# EAGLE design M310B (EAGLE 6.6.0)
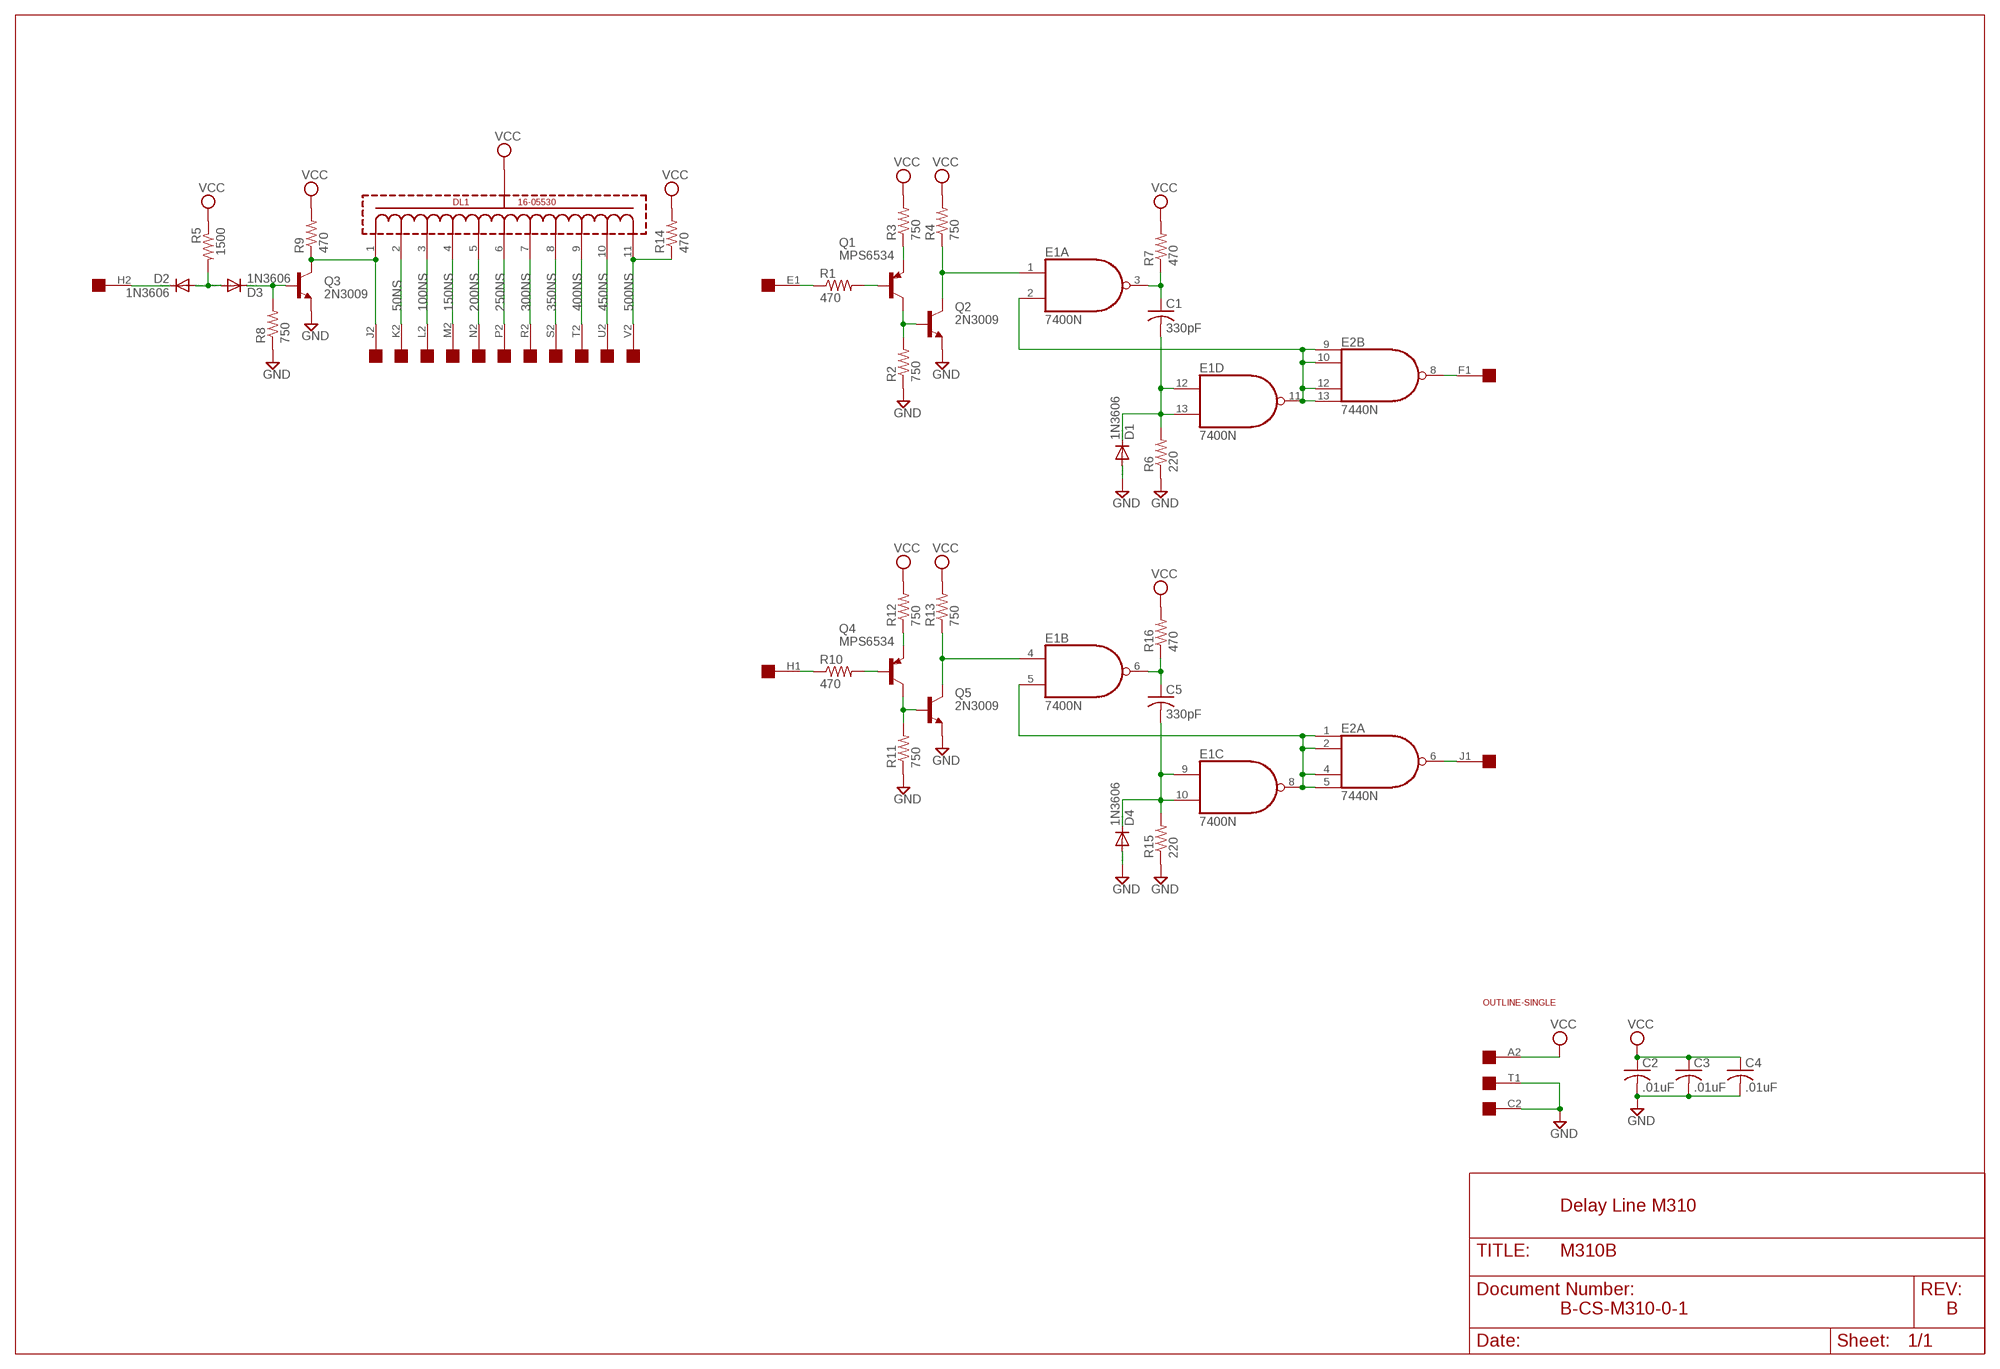
[diagram p0: schematic, sheet 1]

## Parts
C1  330pF  C-US050-025X075  [C050-025X075]
C2  .01uF  C-US050-025X075  [C050-025X075]
C3  .01uF  C-US050-025X075  [C050-025X075]
C4  .01uF  C-US050-025X075  [C050-025X075]
C5  330pF  C-US050-025X075  [C050-025X075]
D1  1N3606  1N4148DO35-10  [DO35-10]
D2  1N3606  1N4148DO35-10  [DO35-10]
D3  1N3606  1N4148DO35-10  [DO35-10]
D4  1N3606  1N4148DO35-10  [DO35-10]
DL1  16-05530  [16-05530]
E1  7400N  [DIL14]
E2  7440N  74S40N  [DIL14]
Q1  MPS6534  2N3637  [TO39]
Q2  2N3009  2N3019-NPN-TO39-EBC  [TO39]
Q3  2N3009  2N3019-NPN-TO39-EBC  [TO39]
Q4  MPS6534  2N3637  [TO39]
Q5  2N3009  2N3019-NPN-TO39-EBC  [TO39]
R1  470  R-US_0207/10  [0207/10]
R2  750  R-US_0207/10  [0207/10]
R3  750  R-US_0207/10  [0207/10]
R4  750  R-US_0207/10  [0207/10]
R5  1500  R-US_0207/10  [0207/10]
R6  220  R-US_0207/10  [0207/10]
R7  470  R-US_0207/10  [0207/10]
R8  750  R-US_0207/10  [0207/10]
R9  470  R-US_0207/10  [0207/10]
R10  470  R-US_0207/10  [0207/10]
R11  750  R-US_0207/10  [0207/10]
R12  750  R-US_0207/10  [0207/10]
R13  750  R-US_0207/10  [0207/10]
R14  470  R-US_0207/10  [0207/10]
R15  220  R-US_0207/10  [0207/10]
R16  470  R-US_0207/10  [0207/10]
U$1  OUTLINE-SINGLE  [SINGLE]
U$4  SINGLE  [EDGE-CON2]

## Nets
50NS: DL1.2 U$4.K2
100NS: DL1.3 U$4.L2
150NS: DL1.4 U$4.M2
200NS: DL1.5 U$4.N2
250NS: DL1.6 U$4.P2
300NS: DL1.7 U$4.R2
350NS: DL1.8 U$4.S2
400NS: DL1.9 U$4.T2
450NS: DL1.10 U$4.U2
500NS: DL1.11 R14.1 U$4.V2
GND [power]: C2.2 C3.2 C4.2 D1.A D4.A Q2.1(E) Q3.1(E) Q5.1(E) R2.1 R6.1 R8.1 R11.1 R15.1 U$4.C2 U$4.T1
N$1: C1.2 D1.C E1.12(D:I0) E1.13(D:I1) R6.2
N$2: D2.C U$4.H2
N$3: D2.A D3.A R5.2
N$4: C1.1 E1.3(A:O) R7.1
N$5: D3.C Q3.2(B) R8.2
N$6: R1.1 U$4.E1
N$7: Q1.2(B) R1.2
N$8: Q1.1(E) R3.1
N$9: Q1.3(C) Q2.2(B) R2.2
N$10: E1.1(A:I0) Q2.3(C) R4.1
N$11: E1.2(A:I1) E1.11(D:O) E2.9(B:I0) E2.10(B:I1) E2.12(B:I2) E2.13(B:I3)
N$12: E2.8(B:O) U$4.F1
N$13: C5.2 D4.C E1.9(C:I0) E1.10(C:I1) R15.2
N$14: R10.1 U$4.H1
N$15: Q4.2(B) R10.2
N$16: Q4.1(E) R12.1
N$17: Q4.3(C) Q5.2(B) R11.2
N$18: E1.4(B:I0) Q5.3(C) R13.1
N$19: C5.1 E1.6(B:O) R16.1
N$20: E1.5(B:I1) E1.8(C:O) E2.1(A:I0) E2.2(A:I1) E2.4(A:I2) E2.5(A:I3)
N$21: E2.6(A:O) U$4.J1
N$23: DL1.1 Q3.3(C) R9.1 U$4.J2
VCC [power]: C2.1 C3.1 C4.1 DL1.12(GND) R3.2 R4.2 R5.1 R7.2 R9.2 R12.2 R13.2 R14.2 R16.2 U$4.A2
Unconnected: E2.3(3:NC) E2.11(11:NC) U$4.A1 U$4.B1 U$4.B2 U$4.C1 U$4.D1 U$4.D2 U$4.E2 U$4.F2 U$4.K1 U$4.L1 U$4.M1 U$4.N1 U$4.P1 U$4.R1 U$4.S1 U$4.U1 U$4.V1

## Notes on the sheet
- Delay Line M310
- B-CS-M310-0-1 | B

## Power pins joined to a net without a drawn wire
GND: E1.7(P:GND) E2.7(P:GND)
VCC: E1.14(P:VCC) E2.14(P:VCC)

## Library data of the parts
C1-C5 = rcl:C-US: CAPACITOR, American symbol
D1-D4 = diode:1N4148: DIODE high speed (Philips)
DL1 = dec-con:16-05530: Delay Line (M310 style)
E1 = 74xx-us:74*00: Quad 2-input NAND gate
E2 = dec-con:74*40: Dual 4-input NAND gate
Q1 Q4 = transistor-pnp:2N3637*: PNP Transistror
Q2 Q3 Q5 = transistor:*-NPN-: NPN Transistror BF959 corrected 2008.03.06
R1-R16 = rcl:R-US_: RESISTOR, American symbol
U$1 = dec-con:OUTLINE-*: Board outlines for DEC boards.
U$4 = dec-con:SINGLE: Single-Height DEC board

## Net classes
1 power: width 0.813 mm

## Board
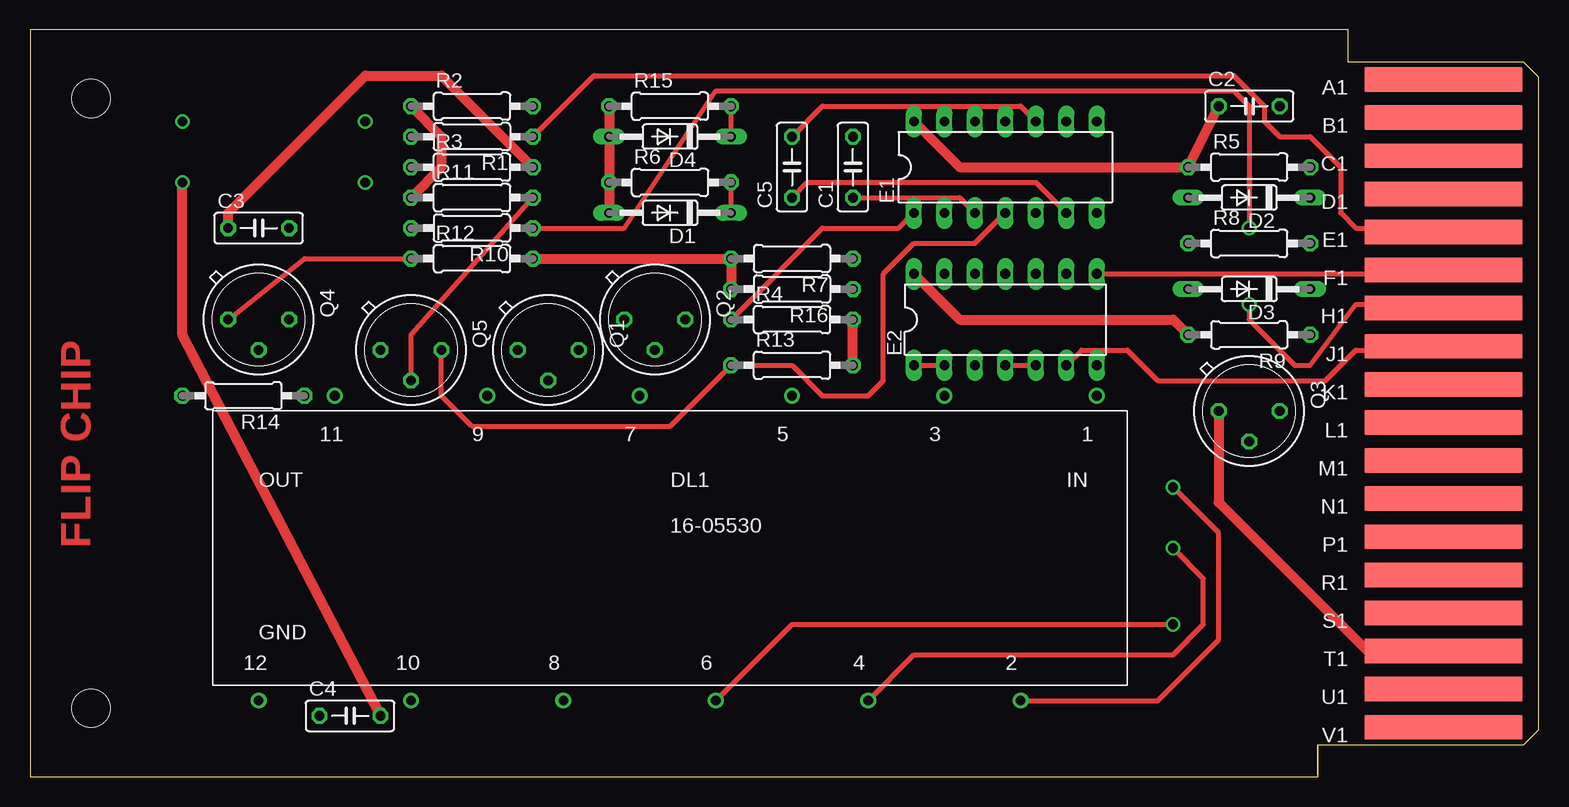
[diagram p1: board, top side]
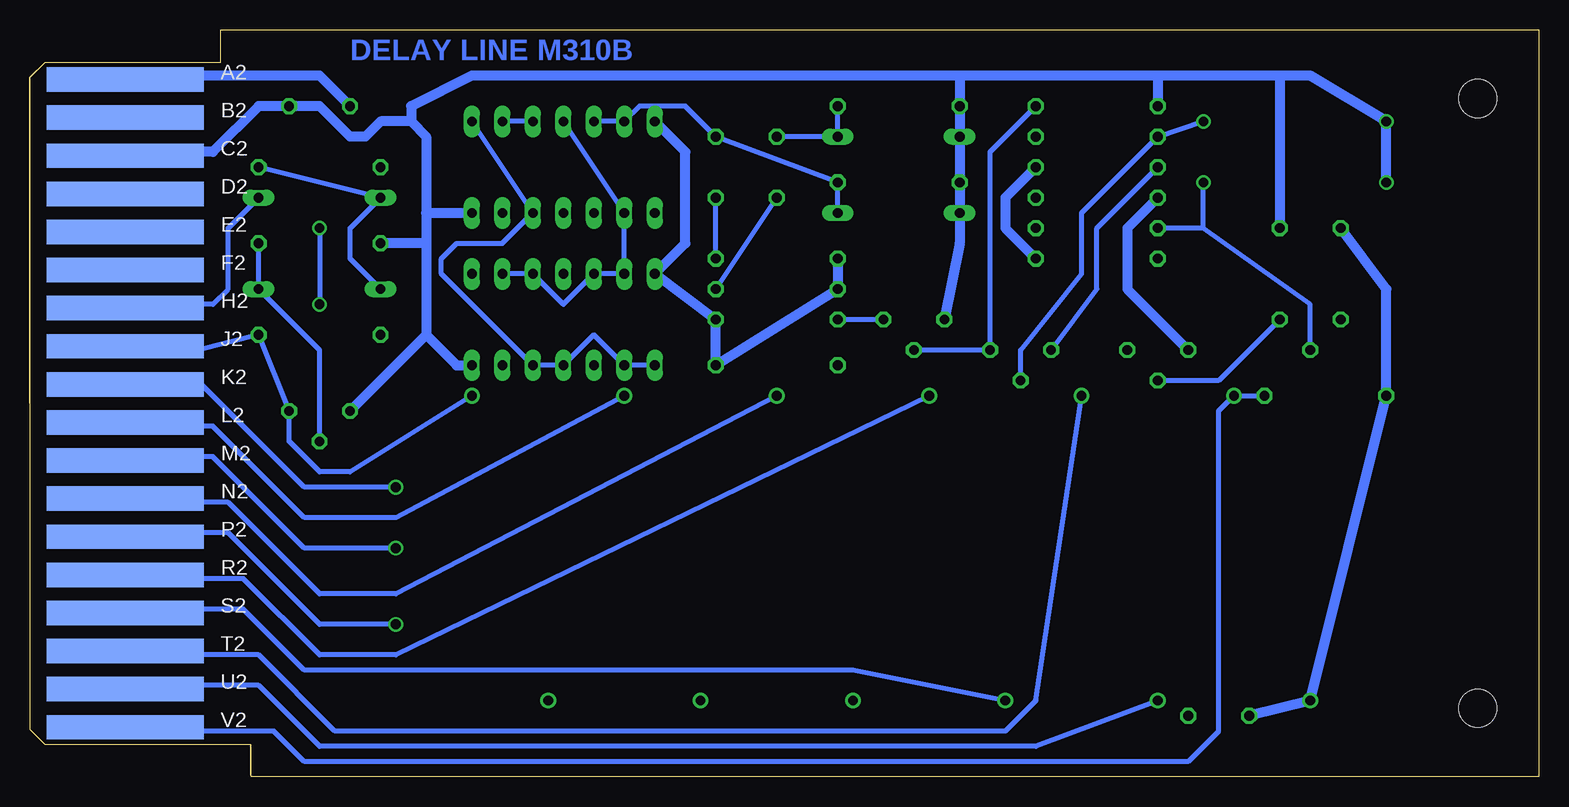
[diagram p2: board, bottom side, seen from below]

Size 125.73 x 62.23 mm. Coordinates in mm from the lower left corner, seen from the top.
Copper layers (1+16): Top 0.035mm / dielectric 1.5mm / Bottom 0.035mm
Design rules "16mils": minimum track width 16mil, minimum drill 32mil, track to track 15mil, track to pad 10mil, pad to pad 10mil, via to via 10mil, smd to smd 10mil, copper to edge 13mil, drill to drill 10mil, minimum pad ring 10mil, minimum via ring 8mil, stop-mask expansion 0mil, vias tented up to drill 0mil, thermal gap 10mil

### Footprints (pad centres in the part's own frame; a part is rotated, then mirrored left to right if it is on the bottom)
C050-025X075 = drill 0.813 octagon: 1 -2.54,0; 2 2.54,0
DO35-10 = drill 0.813 long: A 5.08,0; C -5.08,0
16-05530 = drill 0.813: 1 35.56,12.7; 2 29.21,-12.7; 3 22.86,12.7; 4 16.51,-12.7; 5 10.16,12.7; 6 3.81,-12.7; 7 -2.54,12.7; 8 -8.89,-12.7; 9 -15.24,12.7; 10 -21.59,-12.7; 11 -27.94,12.7; 12 -34.29,-12.7
DIL14 = drill 0.813 long: 1 -7.62,-3.81; 2 -5.08,-3.81; 3 -2.54,-3.81; 4 0,-3.81; 5 2.54,-3.81; 6 5.08,-3.81; 7 7.62,-3.81; 8 7.62,3.81; 9 5.08,3.81; 10 2.54,3.81; 11 0,3.81; 12 -2.54,3.81; 13 -5.08,3.81; 14 -7.62,3.81
TO39 = drill 0.813 octagon: 1 0,-2.54; 2 2.54,0; 3 0,2.54
0207/10 = drill 0.813 octagon: 1 -5.08,0; 2 5.08,0
SINGLE = hole 3.175: 120.65,56.515; 120.65,5.715
EDGE-CON2 = smd 13.106 x 2.032: A1 7.938,4.128; B1 7.938,7.303; C1 7.938,10.477; D1 7.938,13.652; E1 7.938,16.828; F1 7.938,20.003; H1 7.938,23.177; J1 7.938,26.352; K1 7.938,29.527; L1 7.938,32.703; M1 7.938,35.877; N1 7.938,39.053; P1 7.938,42.227; R1 7.938,45.403; S1 7.938,48.578; T1 7.938,51.752; U1 7.938,54.928; V1 7.938,58.102 | smd 13.106 x 2.032 bottom: A2 7.938,4.128; B2 7.938,7.303; C2 7.938,10.477; D2 7.938,13.652; E2 7.938,16.828; F2 7.938,20.003; H2 7.938,23.177; J2 7.938,26.352; K2 7.938,29.527; L2 7.938,32.703; M2 7.938,35.877; N2 7.938,39.053; P2 7.938,42.227; R2 7.938,45.403; S2 7.938,48.578; T2 7.938,51.752; U2 7.938,54.928; V2 7.938,58.102

### Placement (x,y rotation side)
C1  68.58,50.8 90 top
C2  101.6,55.88 0 top
C3  19.05,45.72 0 top
C4  26.67,5.08 0 top
C5  63.5,50.8 90 top
D1  53.34,46.99 180 top
D2  101.6,48.26 180 top
D3  101.6,40.64 180 top
D4  53.34,53.34 180 top
DL1  53.34,19.05 0 top
E1  81.28,50.8 0 top
E2  81.28,38.1 0 top
Q1  43.18,35.56 270 top
Q2  52.07,38.1 270 top
Q3  101.6,30.48 270 top
Q4  19.05,38.1 270 top
Q5  31.75,35.56 270 top
R1  36.83,53.34 180 top
R2  36.83,55.88 0 top
R3  36.83,50.8 0 top
R4  63.5,38.1 0 top
R5  101.6,50.8 0 top
R6  53.34,49.53 0 top
R7  63.5,43.18 180 top
R8  101.6,44.45 0 top
R9  101.6,36.83 180 top
R10  36.83,45.72 180 top
R11  36.83,48.26 0 top
R12  36.83,43.18 0 top
R13  63.5,34.29 0 top
R14  17.78,31.75 180 top
R15  53.34,55.88 0 top
R16  63.5,40.64 180 top
U$1  125.73,62.23 180 top
U$3  [FLIPCHIP]  0,0 0 top
U$4  125.73,62.23 180 top

### Tracks (layer width: path | path; a pad name or v marks a point on that pad's centre or on a via)
50NS  (via drill 0.81)
  Top 0.406: DL1.2 93.98,6.35 99.06,11.43 99.06,20.32 v95.25,24.13
  Bottom 0.406: U$4.K2 117.14,32.72 116.84,33.02 111.76,33.02 102.87,24.13 v95.25,24.13
100NS
  Bottom 0.406: U$4.L2 117.17,29.54 116.84,29.21 110.49,29.21 102.87,21.59 95.25,21.59 DL1.3
150NS  (via drill 0.81)
  Top 0.406: DL1.4 73.66,10.16 95.25,10.16 97.79,12.7 97.79,16.51 v95.25,19.05
  Bottom 0.406: U$4.M2 117.17,26.34 116.84,26.67 110.49,26.67 102.87,19.05 v95.25,19.05
200NS
  Bottom 0.406: U$4.N2 117.17,23.19 116.84,22.86 109.22,22.86 101.6,15.24 95.25,15.24 DL1.5
250NS  (via drill 0.81)
  Top 0.406: v95.25,12.7 63.5,12.7 DL1.6
  Bottom 0.406: U$4.P2 117.17,19.99 116.84,20.32 109.22,20.32 101.6,12.7 v95.25,12.7
300NS
  Bottom 0.406: U$4.R2 117.17,16.84 116.84,16.51 107.95,16.51 101.6,10.16 95.25,10.16 DL1.7
350NS
  Bottom 0.406: U$4.S2 117.14,13.66 116.84,13.97 107.95,13.97 102.87,8.89 57.15,8.89 DL1.8
400NS
  Bottom 0.406: U$4.T2 117.17,10.49 116.84,10.16 106.68,10.16 100.33,3.81 44.45,3.81 41.91,6.35 DL1.9
450NS
  Bottom 0.406: U$4.U2 117.2,7.26 116.84,7.62 106.68,7.62 101.6,2.54 41.91,2.54 DL1.10
500NS
  Bottom 0.406: U$4.V2 117.23,4.2 116.84,3.81 105.41,3.81 102.87,1.27 29.21,1.27 26.67,3.81 26.67,30.48 DL1.11 R14.1
GND  (via drill 0.81)
  Top 0.813: C4.2 12.7,36.83 v12.7,49.53 | U$4.T1 116.84,10.16 111.76,10.16 99.06,22.86 Q3.1 | D1.A R6.1 D4.A R15.1 | R2.1 34.29,53.34 34.29,50.8 R11.1
  Bottom 0.813: U$4.C2 117.17,51.74 116.84,52.07 110.49,52.07 106.68,55.88 C2.2 101.6,55.88 99.06,53.34 97.79,53.34 96.52,54.61 93.98,54.61 | 93.98,54.61 92.71,53.34 92.71,46.99 | 92.71,46.99 E1.7 | 92.71,44.45 R8.1 | 92.71,46.99 92.71,44.45 | E2.7 90.17,34.29 92.71,36.83 | 92.71,36.83 Q3.1 | 92.71,44.45 92.71,36.83 | v12.7,49.53 v12.7,54.61 19.05,58.42 21.59,58.42 | 21.59,58.42 C3.2 | 21.59,58.42 31.75,58.42 | 31.75,58.42 48.26,58.42 | 48.26,58.42 88.9,58.42 93.98,55.88 93.98,54.61 | 48.26,58.42 R15.1 D4.A R6.1 D1.A 48.26,44.45 Q2.1 | 31.75,58.42 R2.1 | Q5.1 34.29,40.64 34.29,45.72 R11.1
N$1
  Top 0.406: D1.C R6.2
  Bottom 0.406: E1.12 E1.13 74.93,55.88 71.12,55.88 C1.2 R6.2 D1.C
N$2
  Bottom 0.406: U$4.H2 117.17,39.04 116.84,39.37 110.49,39.37 109.22,40.64 109.22,45.72 D2.C
N$3
  Bottom 0.406: D3.A 99.06,43.18 99.06,45.72 D2.A R5.2
N$4
  Top 0.406: C1.1 77.47,48.26 E1.3
  Bottom 0.406: R7.1 C1.1
N$5
  Bottom 0.406: R8.2 D3.C 101.6,35.56 Q3.2
N$6
  Top 0.406: U$4.E1 116.84,45.72 110.49,45.72 109.22,46.99 109.22,50.8 106.68,53.34 104.14,53.34 102.87,54.61 102.87,55.88 100.33,58.42 46.99,58.42 R1.1
N$7  (via drill 0.81)
  Bottom 0.406: v27.94,54.61 R1.2 38.1,46.99 38.1,41.91 43.18,35.56 Q1.2
N$8
  Bottom 0.406: R3.1 36.83,45.72 36.83,40.64 Q1.1
N$9
  Bottom 0.406: Q2.2 Q1.3 45.72,52.07 R2.2
N$10
  Top 0.406: E1.1 72.39,45.72 66.04,45.72 R4.1
  Bottom 0.406: Q2.3 R4.1
N$11
  Bottom 0.406: E2.9 E2.10 81.28,39.37 E2.12 E2.13 E1.2 E1.11
N$12
  Top 0.406: U$4.F1 116.84,41.91 E2.8
N$13
  Top 0.406: D4.C R15.2 | C5.2 66.04,55.88 82.55,55.88 E1.10
  Bottom 0.406: E1.10 E1.9 | R15.2 D4.C C5.2
N$14  (via drill 0.81)
  Top 0.406: U$4.H1 116.84,39.37 110.49,39.37 106.68,34.29 105.41,34.29 101.6,38.1 v101.6,39.37 | R10.1 49.53,45.72 57.15,57.15 100.33,57.15 101.6,55.88 v101.6,45.72
  Bottom 0.406: v101.6,45.72 v101.6,39.37
N$15  (via drill 0.81)
  Bottom 0.406: 27.94,45.72 R10.2 | 27.94,45.72 v27.94,49.53 | Q4.2 19.05,39.37 27.94,45.72
N$16
  Top 0.406: R12.1 22.86,43.18 Q4.1
N$17
  Top 0.406: Q5.2 31.75,36.83 R11.2
  Bottom 0.406: Q5.2 26.67,33.02 Q4.3
N$18
  Top 0.406: Q5.3 34.29,31.75 36.83,29.21 53.34,29.21 R13.1 63.5,34.29 66.04,31.75 69.85,31.75 71.12,33.02 71.12,41.91 73.66,44.45 78.74,44.45 E1.4
N$19
  Top 0.406: E1.6 83.82,49.53 64.77,49.53 C5.1
  Bottom 0.406: R16.1 C5.1
N$20
  Top 0.406: E2.4 E2.5 | E2.1 E2.2
  Bottom 0.406: E2.1 E2.2 78.74,36.83 E2.4 E2.5 91.44,41.91 91.44,43.18 90.17,44.45 86.36,44.45 E1.5 E1.8
N$21
  Top 0.406: U$4.J1 116.84,35.56 110.49,35.56 107.95,33.02 93.98,33.02 91.44,35.56 87.63,35.56 E2.6
N$23
  Bottom 0.406: U$4.J2 117.17,35.89 116.84,35.56 111.76,35.56 R9.1 Q3.3 104.14,27.94 101.6,25.4 99.06,25.4 DL1.1
VCC
  Top 0.813: R16.2 R7.2 R12.2 | R13.2 R4.2 | C3.1 16.51,46.99 27.94,58.42 34.29,58.42 R3.2 | R9.2 95.25,38.1 77.47,38.1 E2.14 | C2.1 R5.1 77.47,50.8 E1.14
  Bottom 0.813: U$4.A2 117.24,58.02 116.84,58.42 101.6,58.42 C2.1 | C4.1 DL1.12 R14.2 12.7,40.64 C3.1 | E1.14 71.12,52.07 71.12,44.45 E2.14 R4.2 | R7.2 R16.2 R13.2 | R13.2 R4.2 | R13.2 R4.2 | R3.2 44.45,48.26 44.45,45.72 R12.2

### Text on the board
Bottom: DELAY LINE M310B